# EAGLE design esp32 (EAGLE 8.2.0)
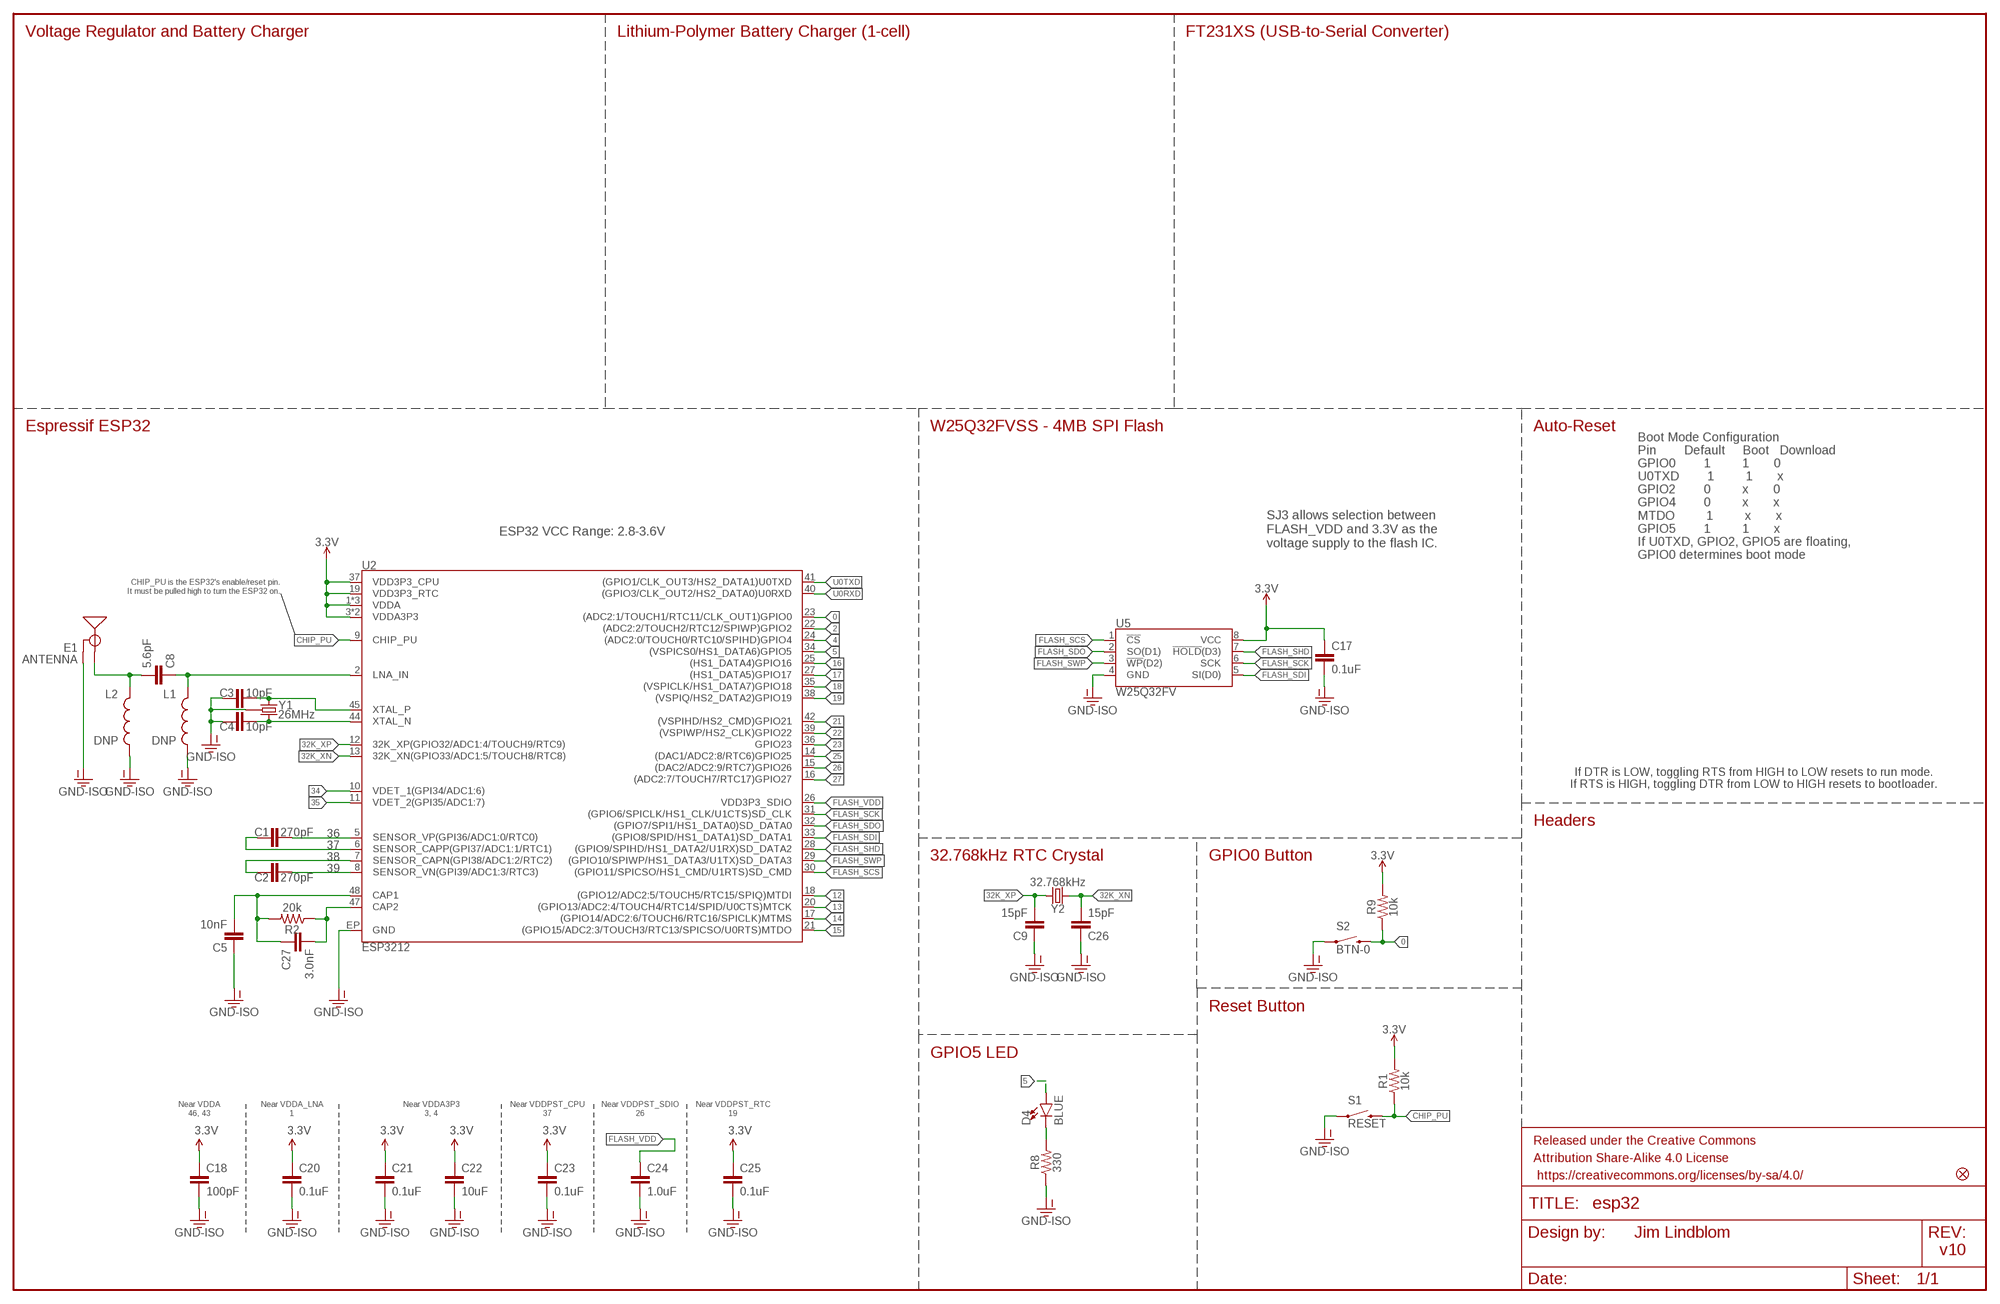
[diagram p0: schematic, sheet 1]

## Parts
C1  270pF  270PF-50V-5%(0603)  [0603]
C2  270pF  270PF-50V-5%(0603)  [0603]
C3  10pF  10PF-0603-50V-5%  [0603]
C4  10pF  10PF-0603-50V-5%  [0603]
C5  10nF  10NF-0603-50V-10%  [0603]
C8  5.6pF  5.6PF-50V-5%(0603)  [0603]
C9  15pF  15PF-0603-50V-5%  [0603]
C17  0.1uF  0.1UF-0603-25V-(+80/-20%)  [0603]
C18  100pF  100PF-0603-50V-5%  [0603]
C20  0.1uF  0.1UF-0603-25V-(+80/-20%)  [0603]
C21  0.1uF  0.1UF-0603-25V-(+80/-20%)  [0603]
C22  10uF  10UF-0603-6.3V-20%  [0603]
C23  0.1uF  0.1UF-0603-25V-(+80/-20%)  [0603]
C24  1.0uF  1.0UF-0603-16V-10%  [0603]
C25  0.1uF  0.1UF-0603-25V-(+80/-20%)  [0603]
C26  15pF  15PF-0603-50V-5%  [0603]
C27  3.0nF  3.0NF-0603-50V-5%  [0603]
D4  BLUE  LED-BLUE0603  [LED-0603]
E1  ANTENNA  ANTENNATRACE-TUNED  [TRACE_ANTENNA_2.4GHZ_25.7MM_TUNED]
FD2  FIDUCIALUFIDUCIAL  [MICRO-FIDUCIAL]
FRAME1  FRAME-LEDGER  [CREATIVE_COMMONS]
L1  DNP  INDUCTOR0603  [0603]
L2  DNP  INDUCTOR0603  [0603]
R1  10k  10KOHM-1/10W-1%(0603)0603  [0603]
R2  20k  20KOHM-0603-1/10W-1%  [0603]
R8  330  330OHM1/10W1%(0603)  [0603]
R9  10k  10KOHM-1/10W-1%(0603)0603  [0603]
S1  RESET  SWITCH-MOMENTARY-2SMD-4.6X2.8MM  [TACTILE_SWITCH_SMD_4.6X2.8MM]
S2  BTN-0  SWITCH-MOMENTARY-2SMD-4.6X2.8MM  [TACTILE_SWITCH_SMD_4.6X2.8MM]
U2  ESP3212  [QFN48-0.4MM]
U5  W25Q32FV  W25Q32FVSS  [SOIC-8]
Y1  26MHz  CRYSTAL-GROUNDED3.2X2.5  [CRYSTAL-SMD-3.2X2.5]
Y2  32.768kHz  CRYSTAL-32.768KHZSMD-3.2X1.5  [CRYSTAL-SMD-3.2X1.5MM]

## Nets
0: R9.1 S2.3 S2.4 U2.23((ADC2:1/TOUCH1/RTC11/CLK_OUT1)GPIO0)
2: U2.22((ADC2:2/TOUCH2/RTC12/SPIWP)GPIO2)
3.3V: C17.1 C18.1 C20.1 C21.1 C22.1 C23.1 C25.1 R1.2 R9.2 U2.1(VDDA) U2.3(VDDA3P3) U2.4(VDDA3P3) U2.19(VDD3P3_RTC) U2.37(VDD3P3_CPU) U2.43(VDDA) U2.46(VDDA) U5.8(VCC)
4: U2.24((ADC2:0/TOUCH0/RTC10/SPIHD)GPIO4)
5: D4.A U2.34((VSPICS0/HS1_DATA6)GPIO5)
12: U2.18((GPIO12/ADC2:5/TOUCH5/RTC15/SPIQ)MTDI)
13: U2.20((GPIO13/ADC2:4/TOUCH4/RTC14/SPID/U0CTS)MTCK)
14: U2.17((GPIO14/ADC2:6/TOUCH6/RTC16/SPICLK)MTMS)
15: U2.21((GPIO15/ADC2:3/TOUCH3/RTC13/SPICSO/U0RTS)MTDO)
16: U2.25((HS1_DATA4)GPIO16)
17: U2.27((HS1_DATA5)GPIO17)
18: U2.35((VSPICLK/HS1_DATA7)GPIO18)
19: U2.38((VSPIQ/HS2_DATA2)GPIO19)
21: U2.42((VSPIHD/HS2_CMD)GPIO21)
22: U2.39((VSPIWP/HS2_CLK)GPIO22)
23: U2.36(GPIO23)
25: U2.14((DAC1/ADC2:8/RTC6)GPIO25)
26: U2.15((DAC2/ADC2:9/RTC7)GPIO26)
27: U2.16((ADC2:7/TOUCH7/RTC17)GPIO27)
32K_XN: C26.2 U2.13(32K_XN(GPIO33/ADC1:5/TOUCH8/RTC8)) Y2.P$2
32K_XP: C9.2 U2.12(32K_XP(GPIO32/ADC1:4/TOUCH9/RTC9)) Y2.P$1
34: U2.10(VDET_1(GPI34/ADC1:6))
35: U2.11(VDET_2(GPI35/ADC1:7))
36: C1.2 U2.5(SENSOR_VP(GPI36/ADC1:0/RTC0))
37: C1.1 U2.6(SENSOR_CAPP(GPI37/ADC1:1/RTC1))
38: C2.1 U2.7(SENSOR_CAPN(GPI38/ADC1:2/RTC2))
39: C2.2 U2.8(SENSOR_VN(GPI39/ADC1:3/RTC3))
CAP_10N: C5.2 C27.1 R2.2 U2.48(CAP1)
CHIP_PU: R1.1 S1.3 S1.4 U2.9(CHIP_PU)
FLASH_SCK: U2.31((GPIO6/SPICLK/HS1_CLK/U1CTS)SD_CLK) U5.6(SCK)
FLASH_SCS: U2.30((GPIO11/SPICSO/HS1_CMD/U1RTS)SD_CMD) U5.1(!CS!)
FLASH_SDI: U2.33((GPIO8/SPID/HS1_DATA1)SD_DATA1) U5.5(SI(D0))
FLASH_SDO: U2.32((GPIO7/SPI1/HS1_DATA0)SD_DATA0) U5.2(SO(D1))
FLASH_SHD: U2.28((GPIO9/SPIHD/HS1_DATA2/U1RX)SD_DATA2) U5.7(!HOLD!(D3))
FLASH_SWP: U2.29((GPIO10/SPIWP/HS1_DATA3/U1TX)SD_DATA3) U5.3(!WP!(D2))
FLASH_VDD: C24.1 U2.26(VDD3P3_SDIO)
GND: C3.1 C4.1 C5.1 C9.1 C17.2 C18.2 C20.2 C21.2 C22.2 C23.2 C24.2 C25.2 C26.1 E1.GND E1.GND2(GND) L1.2 L2.2 R8.1 S1.1 S1.2 S2.1 S2.2 U2.EP(GND) U5.4(GND) Y1.2(GND) Y1.4(GND) ; supply symbol labelled GND-ISO
LNA_IN: C8.1 L1.1 U2.2(LNA_IN)
N$1: D4.C R8.2
N$4: C27.2 R2.1 U2.47(CAP2)
N$13: C3.2 U2.45(XTAL_P) Y1.1
N$15: C4.2 U2.44(XTAL_N) Y1.3
TRACE_ANT: C8.2 E1.ANT(SIGNAL) L2.1
U0RXD: U2.40((GPIO3/CLK_OUT2/HS2_DATA0)U0RXD)
U0TXD: U2.41((GPIO1/CLK_OUT3/HS2_DATA1)U0TXD)

## Notes on the sheet
- Voltage Regulator and Battery Charger | Lithium-Polymer Battery Charger (1-cell) | FT231XS (USB-to-Serial Converter)
- Espressif ESP32 | W25Q32FVSS - 4MB SPI Flash | Auto-Reset
- ESP32 VCC Range: 2.8-3.6V
- SJ3 allows selection between 
  FLASH_VDD and 3.3V as the
  voltage supply to the flash IC.
- Boot Mode Configuration
  Pin        Default     Boot   Download
  GPIO0        1         1       0
  U0TXD        1         1       x
  GPIO2        0         x       0
  GPIO4        0         x       x
  MTDO         1         x       x
  GPIO5        1         1       x
  If U0TXD, GPIO2, GPIO5 are floating, 
  GPIO0 determines boot mode
- CHIP_PU is the ESP32's enable/reset pin.
  It must be pulled high to turn the ESP32 on.
- If DTR is LOW, toggling RTS from HIGH to LOW resets to run mode.
  If RTS is HIGH, toggling DTR from LOW to HIGH resets to bootloader.
- Headers
- 32.768kHz RTC Crystal | GPIO0 Button
- Reset Button
- GPIO5 LED
- Near VDDA
  46, 43
- Near VDDA_LNA
  1
- Near VDDA3P3
  3, 4
- Near VDDPST_CPU
  37
- Near VDDPST_SDIO
  26
- Near VDDPST_RTC
  19
- Jim Lindblom
- v10

## Library data of the parts
C1 C2 = esp32-thing-temp:270PF-50V-5%(0603): CAP-13339; PROD_ID: CAP-13339
C3 C4 = SparkFun-Capacitors:10PF: 10pF ceramic capacitors A capacitor is a passive two-terminal electrical component used to store electrical energy temporarily in an electric field.; PROD_ID: CAP-11812
C5 = SparkFun-Capacitors:10NF: 0.01uF/10nF/10,000pF ceramic capacitors A capacitor is a passive two-terminal electrical component used to store electrical energy temporarily in an electric field. CAP-09321; PROD_ID: CAP-00867
C8 = esp32-thing-temp:5.6PF-50V-5%(0603): CAP-12456; PROD_ID: CAP-12456
C9 C26 = SparkFun-Capacitors:15PF: 15pF ceramic capacitors A capacitor is a passive two-terminal electrical component used to store electrical energy temporarily in an electric field.; PROD_ID: CAP-07881
C17 C20 C21 C23 C25 = SparkFun-Capacitors:0.1UF: 0.1µF ceramic capacitors A capacitor is a passive two-terminal electrical component used to store electrical energy temporarily in an electric field.; PROD_ID: CAP-00810
C18 = SparkFun-Capacitors:100PF: 100pF/0.1nF ceramic capacitors A capacitor is a passive two-terminal electrical component used to store electrical energy temporarily in an electric field.; PROD_ID: CAP-07883
C22 = SparkFun-Capacitors:10UF: 10.0µF ceramic capacitors A capacitor is a passive two-terminal electrical component used to store electrical energy temporarily in an electric field.; PROD_ID: CAP-11015
C24 = SparkFun-Capacitors:1.0UF: 1µF ceramic capacitors A capacitor is a passive two-terminal electrical component used to store electrical energy temporarily in an electric field.; PROD_ID: CAP-00868
C27 = esp32-thing-temp:3.0NF: 3.0nF (3nF, 3000pF) ceramic capacitors A capacitor is a passive two-terminal electrical component used to store electrical energy temporarily in an electric field.; PROD_ID: CAP-13515
D4 = SparkFun-LED:LED-BLUE: Blue SMD LED Used in manufacturing of various products at SparkFun 0603 - SMD 0603 package Manufacturer: Rohm Semiconductor Forward Voltage: 2.9V Forward Current: 5mA Wavelength: 470nm Digikey: [Product Link] <http://www.digikey.com/product-detail/en/SMLE12BC7TT86/511-1589-2-ND/1641808> 1206 - SMD1206 package Manufacturer:Lite-On Inc. Forward Voltage: 3.3V Forward Current: 20mA Wavelength: 468nm Digikey: [Product Link] <http://www.digikey.com/product-detail/en/lite-on-inc/LTST-C150TBKT/160-1643-1-ND/573584>; PROD_ID: DIO-08575
E1 = derek:ANTENNA: Chip antenna Chip antenna with ground or secondary connection. Common with larger metal RF connectors.
FD2 = SparkFun-Aesthetics:FIDUCIAL: Fiducial Alignment Points Various fiducial points for machine vision alignment.
FRAME1 = SparkFun-Aesthetics:FRAME-LEDGER: Schematic Frame Standard 11x14 US Ledger frame
L1 L2 = SparkFun-Passives:INDUCTOR: Inductors Basic Inductor/Choke - 0603 and 1206. Footprints are not proven and vary greatly between part numbers. INDUCTOR POWER 3.3UH 4.0A SMD 0.197" L x 0.197" W x 0.177" H (5.00mm x 5.00mm x 4.50mm)
R1 R9 = SparkFun-Resistors:10KOHM-1/10W-1%(0603): RES-00824; PROD_ID: RES-00824; VALUE: 10K
R2 = SparkFun-Resistors:20KOHM: 20kΩ resistor A resistor is a passive two-terminal electrical component that implements electrical resistance as a circuit element. Resistors act to reduce current flow, and, at the same time, act to lower voltage levels within circuits. - Wikipedia; PROD_ID: RES-09383
R8 = SparkFun-Resistors:330OHM1/10W1%(0603): RES-00818; PROD_ID: RES-00818
S1 S2 = SparkFun-Electromechanical:SWITCH-MOMENTARY-2: Various NO switches- pushbuttons, reed, etc; PROD_ID: SWCH-13065
U2 = derek:ESP3212; PROD_ID: IC-13338
U5 = derek:W25Q32FV: W25Q32FV 32Mb (4MB) Serial Flash Memory The W25Q32FV support the standard Serial Peripheral Interface (SPI), Dual/Quad I/O SPI as well as 2-clocks instruction cycle Quad Peripheral Interface (QPI). 104MHz, SPI, 8-SOIC-EIAJ Datasheet <http://www.winbond.com/resource-files/w25q32fv%20revh%20091613.pdf> SparkFun Products SparkFun Blynk Board - ESP8266 <https://www.sparkfun.com/products/13794> (WRL-13794); PROD_ID: IC-13229
Y1 = things:CRYSTAL-GROUNDED; PROD_ID: XTAL-12454
Y2 = SparkFun-Clocks:CRYSTAL-32.768KHZ: 32.768kHz Crystal Frequency: 32.768kHz Frequency Stability: ±20ppm Load Capacitance: 12.5pF (PTH-2X6 & SMD-3.2X1.5), 6pF (SMD-2X6); PROD_ID: XTAL-13062

## Board
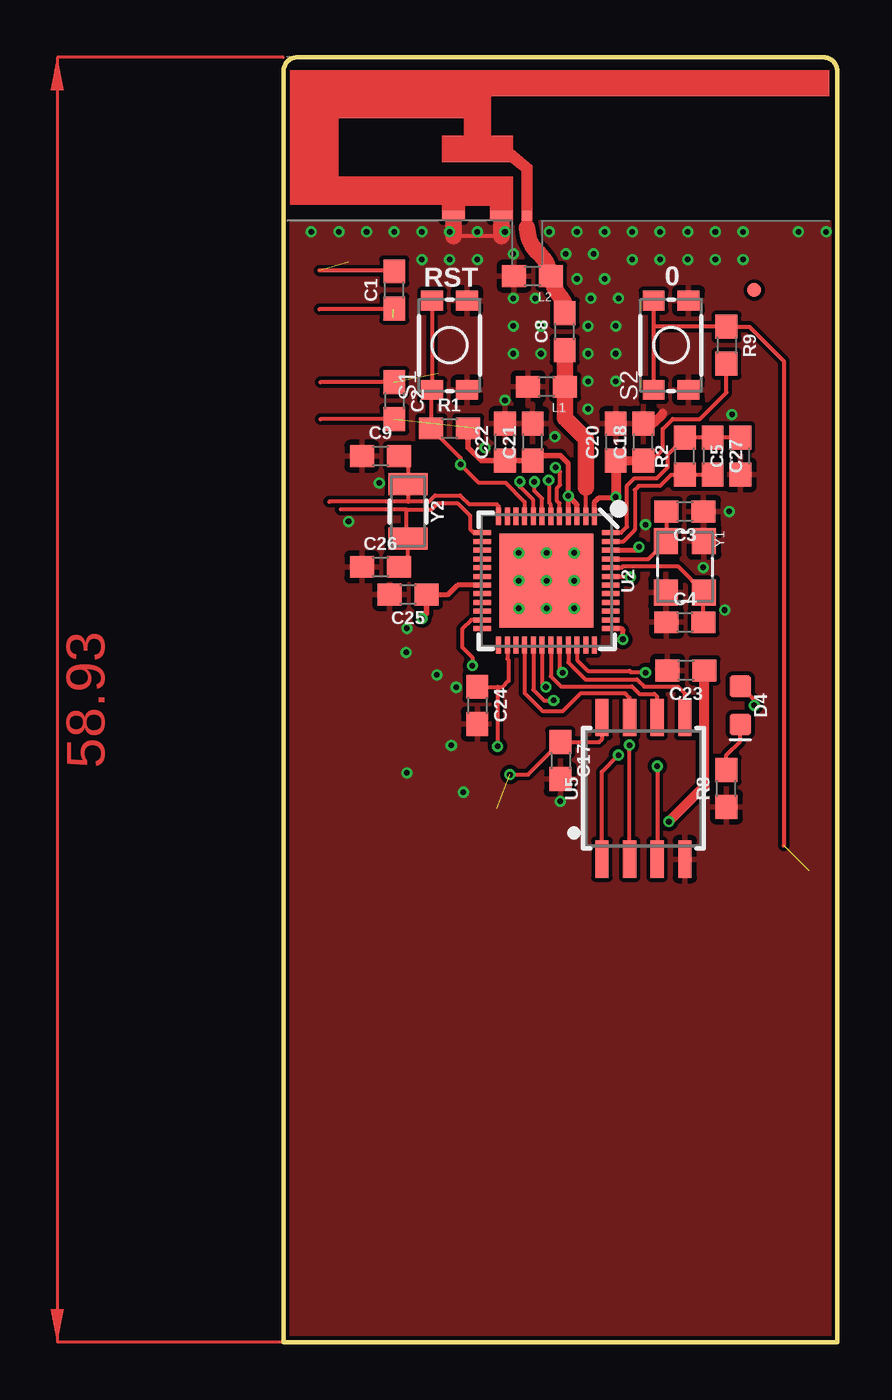
[diagram p1: board, top side]
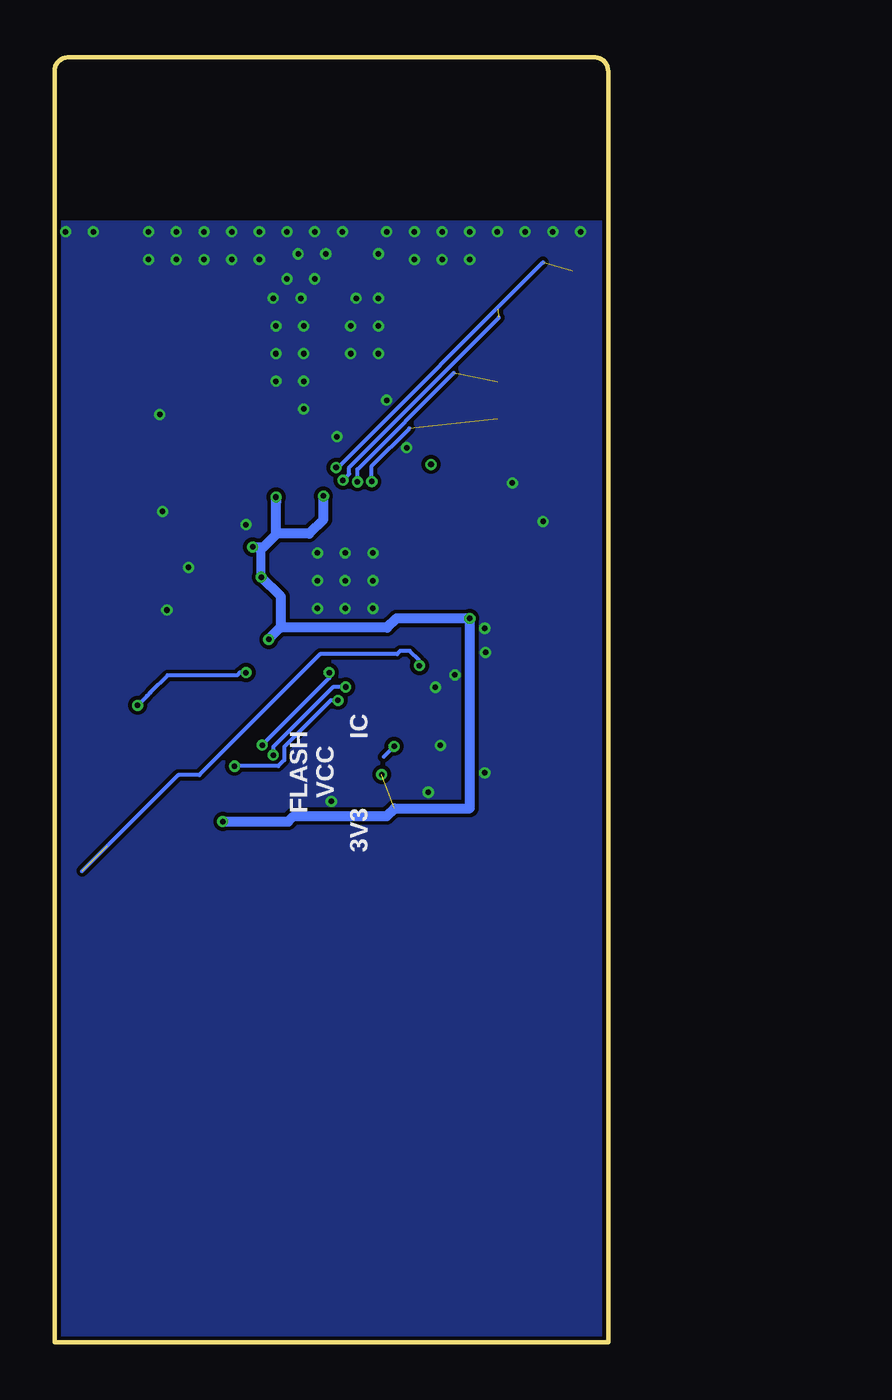
[diagram p2: board, bottom side, seen from below]

Size 25.4 x 58.93 mm. Coordinates in mm from the lower left corner, seen from the top.
Outline: 0,0 0,58.29 arc-90 0.64,58.93 24.77,58.93 arc-90 25.4,58.29 25.4,0 0,0
Copper layers (1*16): Top 0.035mm / dielectric 1.5mm / Bottom 0.035mm
Design rules "SparkFun-2-layer-FAB-LIMIT *": minimum track width 6mil, minimum drill 6mil, track to track 6mil, track to pad 6mil, pad to pad 6mil, via to via 6mil, smd to smd 6mil, copper to edge 4mil, drill to drill 4mil, minimum pad ring 5mil, minimum via ring 5mil, stop-mask expansion 4mil, vias tented up to drill 25mil, thermal gap 10mil

### Footprints (pad centres in the part's own frame; a part is rotated, then mirrored left to right if it is on the bottom)
0603 = smd 1.1 x 1: 1 -0.85,0; 2 0.85,0
LED-0603 = smd 1 x 1: A 0,-0.877; C 0,0.877
TRACE_ANTENNA_2.4GHZ_25.7MM_TUNED = smd 0.46 x 0.46: ANT 0,0.23 | smd 1 x 0.46: GND -1.18,0.23; GND2 -3.38,0.23
MICRO-FIDUCIAL = smd 0.635 x 0.635: 1 0,0
TACTILE_SWITCH_SMD_4.6X2.8MM = smd 0.9 x 1: 1 -2.05,-0.8; 2 2.05,-0.8; 3 2.05,0.8; 4 -2.05,0.8
QFN48-0.4MM = smd 0.8 x 0.23: 1 -2.95,2.2; 2 -2.95,1.8; 3 -2.95,1.4; 4 -2.95,1; 5 -2.95,0.6; 6 -2.95,0.2; 7 -2.95,-0.2; 8 -2.95,-0.6; 9 -2.95,-1; 10 -2.95,-1.4; 11 -2.95,-1.8; 12 -2.95,-2.2; 25 2.95,-2.2; 26 2.95,-1.8; 27 2.95,-1.4; 28 2.95,-1; 29 2.95,-0.6; 30 2.95,-0.2; 31 2.95,0.2; 32 2.95,0.6; 33 2.95,1; 34 2.95,1.4; 35 2.95,1.8; 36 2.95,2.2 | smd 0.23 x 0.8: 13 -2.2,-2.95; 14 -1.8,-2.95; 15 -1.4,-2.95; 16 -1,-2.95; 17 -0.6,-2.95; 18 -0.2,-2.95; 19 0.2,-2.95; 20 0.6,-2.95; 21 1,-2.95; 22 1.4,-2.95; 23 1.8,-2.95; 24 2.2,-2.95; 37 2.2,2.95; 38 1.8,2.95; 39 1.4,2.95; 40 1,2.95; 41 0.6,2.95; 42 0.2,2.95; 43 -0.2,2.95; 44 -0.6,2.95; 45 -1,2.95; 46 -1.4,2.95; 47 -1.8,2.95; 48 -2.2,2.95 | smd 4.3 x 4.3: EP 0,0
SOIC-8 = smd 0.61 x 1.702: 1 -1.905,-3.251; 2 -0.635,-3.251; 3 0.635,-3.251; 4 1.905,-3.251; 5 1.905,3.251; 6 0.635,3.251; 7 -0.635,3.251; 8 -1.905,3.251
CRYSTAL-SMD-3.2X2.5 = smd 1.2 x 1.1: 1 -1.175,-0.875; 2 1.175,-0.875; 3 1.175,0.875; 4 -1.175,0.875
CRYSTAL-SMD-3.2X1.5MM = smd 1 x 1.8: P$1 -1.25,0; P$2 1.25,0

### Placement (x,y rotation side)
C1  5.08,48.26 90 top
C2  5.08,43.18 270 top
C3  18.41,38.1 180 top
C4  18.41,33.02 0 top
C5  20.95,40.64 90 top
C8  12.9,46.35 90 top
C9  4.45,40.64 0 top
C17  12.7,26.67 270 top
C18  16.51,41.27 90 top
C20  15.24,41.27 90 top
C21  11.43,41.27 90 top
C22  10.16,41.27 90 top
C23  18.47,30.81 180 top
C24  8.89,29.21 270 top
C25  5.71,34.29 180 top
C26  4.45,35.56 0 top
C27  19.68,40.64 270 top
D4  20.95,29.21 180 top
E1  11.18,51.44 0 top
FD2  21.59,48.26 0 top
FRAME1  -17.14,-19.05 0 top  (outside the outline)
L1  12.06,43.81 180 top
L2  11.43,48.9 180 top
R1  7.62,41.91 0 top
R2  18.41,40.64 90 top
R8  20.32,25.4 90 top
R9  20.32,45.72 270 top
S1  7.62,45.72 90 top
S2  17.78,45.72 90 top
U2  12.06,34.92 270 top
U5  16.51,25.4 0 top
Y1  18.41,35.56 270 top
Y2  5.71,38.1 270 top

### Tracks (layer width: path | path; a pad name or v marks a point on that pad's centre or on a via)
0  (via drill 0.25)  (1 unrouted)
  Top 0.178: U2.23 8.61,33.12 8.19,32.7 8.19,31.88 8.66,31.41 v8.66,31.03 | S2.4 16.98,46.57 | 16.98,46.57 S2.3 | 16.98,46.57 R9.1 21.38,46.57 22.95,45 22.95,22.77
  Bottom 0.178: v8.66,31.03 8.66,31.25 9.11,31.7 9.54,31.7 9.68,31.56 13.21,31.56 18.76,26.01 19.72,26.01 24.13,21.6
3.3V  (via drill 0.25)  (1 unrouted)
  Top 0.178: 6.35,34.08 C25.1 | 15.21,38.73 v15.24,38.76 | R9.2 20.32,43.56 19.1,42.34 17.86,42.34 17.4,41.88 17.4,40.95 16.88,40.42 C18.1 | U2.43 15.88,35.12 v15.91,35.09 | U5.8 14.61,27.65 14.48,27.52 C17.1 11.21,26.04 v10.39,26.04
  Top 0.229: U2.19 7.99,34.73 7.56,34.29 C25.1 | U2.1 14.27,38.52 14.48,38.73 15.21,38.73 | U2.46 16.16,36.33 v16.31,36.47 | 15.1,32.73 U2.37 15.5,32.73 15.57,32.65 v15.57,32.23 | 12.71,40.65 13.06,40.3 v13.06,38.81 | U2.4 v13.06,38.81 | U2.3 13.46,38.41 v13.06,38.81
  Top 0.254: 12.71,40.65 11.66,40.65 C21.1 C22.1 9.08,40.42 8.47,41.03 R1.2 | v6.35,33.2 6.57,33.41 C25.1
  Top 0.406: C20.1 C18.1
  Top 0.457: C20.1 v15.24,38.76 | 19.3,30.81 C23.1 19.32,25.51 v17.68,23.88
  Bottom 0.406: 15.88,36.47 15.8,36.47 | v15.91,35.09 15.91,36.47 v16.31,36.47
  Bottom 0.457: 15.24,38.48 v15.24,38.76 15.24,37.03 | v16.31,36.47 15.8,36.47 15.24,37.03 | v17.68,23.88 14.68,23.88 14.43,24.13 11.43,24.13 10.16,24.13 9.8,24.49 6.35,24.49 v6.35,33.2 9.7,33.2 10.13,32.77 15.02,32.77 15.02,32.81 | v15.91,35.09 15.02,34.19 15.02,32.81 | 15.02,32.81 15.57,32.26 v15.57,32.23 | 15.24,37.03 15.19,37.08 13.72,37.08 13.06,37.73 v13.06,38.81
5  (via drill 0.25)
  Top 0.178: U2.34 13.46,31.29 13.97,30.79 15.88,30.79 15.93,30.73 16.59,30.73 v16.61,30.71 | D4.A 21.59,29.45 v21.59,29.21
  Bottom 0.178: v16.61,30.71 16.9,30.71 17.03,30.58 20.22,30.58 21.01,29.79 21.16,29.64 v21.59,29.21
32K_XN
  Top 0.178: U2.13 8.72,37.12 8.57,37.27 8.57,37.88 7.98,38.48 7.09,38.48 6.79,38.19 5.64,38.19 | 6.18,36.85 Y2.P$2 | 5.64,38.19 2.63,38.19 | Y2.P$2 5.64,36.85 5.64,38.19 | C26.2 5.71,35.98 Y2.P$2
32K_XP
  Top 0.178: U2.12 9.87,38.33 9.78,38.42 8.52,38.42 8.1,38.84 6.96,38.84 6.67,38.54 5.71,38.54 | 5.71,38.54 2.1,38.54 | 5.71,38.54 Y2.P$1 5.71,40.22 C9.2
36  (via drill 0.25)  (1 unrouted)
  Top 0.178: C1.2 5.04,49.15 1.65,49.15 | U2.5 12.66,38.47 12.55,38.58 12.55,39.18 12.69,39.32 12.69,39.92 v12.48,40.12
  Bottom 0.178: v12.48,40.12 12.39,40.12 2.98,49.53
37  (via drill 0.25)  (1 unrouted)
  Top 0.178: C1.1 5.04,47.37 1.65,47.37 | U2.6 12.27,38.41 12.21,38.47 12.21,39.5 v12.17,39.53
  Bottom 0.178: 5.02,46.99 11.89,40.12 11.89,39.81 v12.17,39.53
38  (via drill 0.25)  (1 unrouted)
  Top 0.178: C2.1 1.69,44.03 | U2.7 11.87,38.68 11.51,39.04 v11.51,39.46
  Bottom 0.178: v11.51,39.46 11.51,40.03 7.09,44.45
39  (via drill 0.25)  (1 unrouted)
  Top 0.178: C2.2 1.69,42.33 | U2.8 11.46,38.61 10.85,39.23 v10.85,39.47
  Bottom 0.178: v10.85,39.47 10.85,40.18 9.12,41.91
CAP_10N
  Top 0.178: C5.2 C27.1 R2.2 17.63,40.7 17.63,40.13 17.12,39.62 16.1,39.62 15.76,39.28 15.76,37.4 15.48,37.12 U2.48
CHIP_PU  (via drill 0.25)
  Top 0.178: S1.3 S1.4 6.77,43.62 R1.1 8.13,40.55 v8.13,40.26 8.98,39.41 10.2,39.41 11.06,38.54 U2.9
  Bottom 0.178: 8.1,40.23 v8.13,40.26
FLASH_SCK
  Top 0.178: U2.31 12.27,30.53 12.72,30.07 15.98,30.07 16.32,29.73 17,29.73 17.14,29.59 U5.6
FLASH_SCS  (via drill 0.25)
  Top 0.178: U2.30 11.87,30.22 v12.04,30.05 | U5.1 14.61,26.16 v15.37,26.92
  Bottom 0.178: v15.37,26.92 15.37,27.3 12.62,30.05 v12.04,30.05
FLASH_SDI
  Top 0.178: U2.33 13.06,31.18 13.84,30.4 16.2,30.4 16.55,30.06 18.1,30.06 18.41,29.74 U5.5
FLASH_SDO  (via drill 0.25)
  Top 0.178: U2.32 12.66,30.84 v12.8,30.71 | U5.2 v15.88,27.38
  Bottom 0.178: v12.8,30.71 12.8,30.45 v15.88,27.38
FLASH_SHD
  Top 0.178: U5.7 15.88,29.55 15.68,29.74 13.61,29.74 12.8,28.93 11.91,28.93 11.06,29.78 U2.28
FLASH_SWP  (via drill 0.25)
  Top 0.178: v17.14,26.42 U5.3 | U2.29 11.46,29.91 11.94,29.44 v12.39,29.44
  Bottom 0.178: v12.39,29.44 12.72,29.44 14.86,27.3 14.86,26.7 15.14,26.42 v17.14,26.42
FLASH_VDD  (via drill 0.25)
  Top 0.178: C24.1 9.82,30.06 | 9.82,30.06 v9.82,27.33 | U2.26 10.27,31.34 10.32,31.28 10.32,30.34 10.05,30.06 9.82,30.06
  Bottom 0.178: 10.3,26.85 v9.82,27.33
GND  (via drill 0.25)
  Top 0.178: 10,50.72 7.8,50.72
  Top 0.406: C18.2 16.93,42.12 17.4,42.6
  Top 0.762: E1.GND 10,50.72 | 7.8,50.72 E1.GND2
  other vias: 4.39,39.41 7.7,27.37 5.66,32.74 7.04,30.61 5.63,31.64 10.79,34.92 10.79,36.2 12.06,36.2 13.34,36.2 13.34,34.92 13.34,33.66 12.06,33.66 10.79,33.66 2.98,37.64 7.62,50.93 6.35,50.93 5.08,50.93 3.81,50.93 2.54,50.93 1.27,50.93 8.89,50.93 10.16,50.93 12.19,50.93 13.46,50.93 14.73,50.93 16,50.93 17.27,50.93 18.54,50.93 19.81,50.93 21.08,50.93 23.62,50.93 24.89,50.93 10.54,49.91 12.95,49.91 11.56,47.88 14.1,47.88 13.46,48.77 11.81,46.61 13.97,46.61 11.81,45.34 13.97,45.34 13.97,44.07 13.97,42.8 12.45,41.53 10.54,46.61 10.54,45.34 10.54,47.88 8.89,49.66 7.62,49.66 6.35,49.66 14.22,49.91 14.73,48.77 15.37,47.88 15.24,46.61 15.24,45.34 15.24,44.07 16,49.66 17.27,49.66 18.54,49.66 19.81,49.66 21.08,49.66 20.45,38.1 20.57,42.55 19.25,35.53 12.06,34.92 20.24,33.58 9.25,41.02 5.66,26.11 8.26,25.22 12.7,24.8 10.16,43.21 7.92,30.04 16.61,37.49
  pour Top (isolate 0.178, rank 6): 0,58.93 0,0 25.4,0 25.4,58.93
  pour Bottom (isolate 0.178, rank 6): 25.4,58.93 25.4,0 0,0 0,58.93
LNA_IN
  Top 0.178: L1.1 12.9,43.83 | U2.2 13.87,39.2
  Top 0.762: L1.1 12.91,42.37 13.87,41.42 13.87,39.2 | 12.9,43.83 C8.1
N$1
  Top 0.178: R8.2 20.32,26.92 20.95,27.56 D4.C
N$4
  Top 0.178: C27.2 R2.1 17.79,39.79 17.27,39.27 16.29,39.27 16.12,39.09 16.12,37.25 15.59,36.73 U2.47
N$13
  Top 0.178: C3.2 17.57,36.76 Y1.1 16.73,35.92 U2.45
N$15
  Top 0.178: C4.2 19.27,34.36 Y1.3 18.09,35.59 15.57,35.59 15.51,35.52 U2.44
TRACE_ANT
  Top 0.178: E1.ANT 11.18,51.1
  Top 0.762: 11.18,51.1 arc46 11.71,49.94 arc-35 L2.1 arc33 12.75,47.88 arc-37 12.88,47.57 12.88,47.23 C8.2
(copper drawn outside any net)
  shapes: Top area x1

### Text on the board
tPlace: RST | 0
bPlace: IC | FLASH / VCC | 3V3
tDocu: Jim Lindblom